# EAGLE design Bases_Aire_Sensors_v4 (EAGLE 9.6.2)
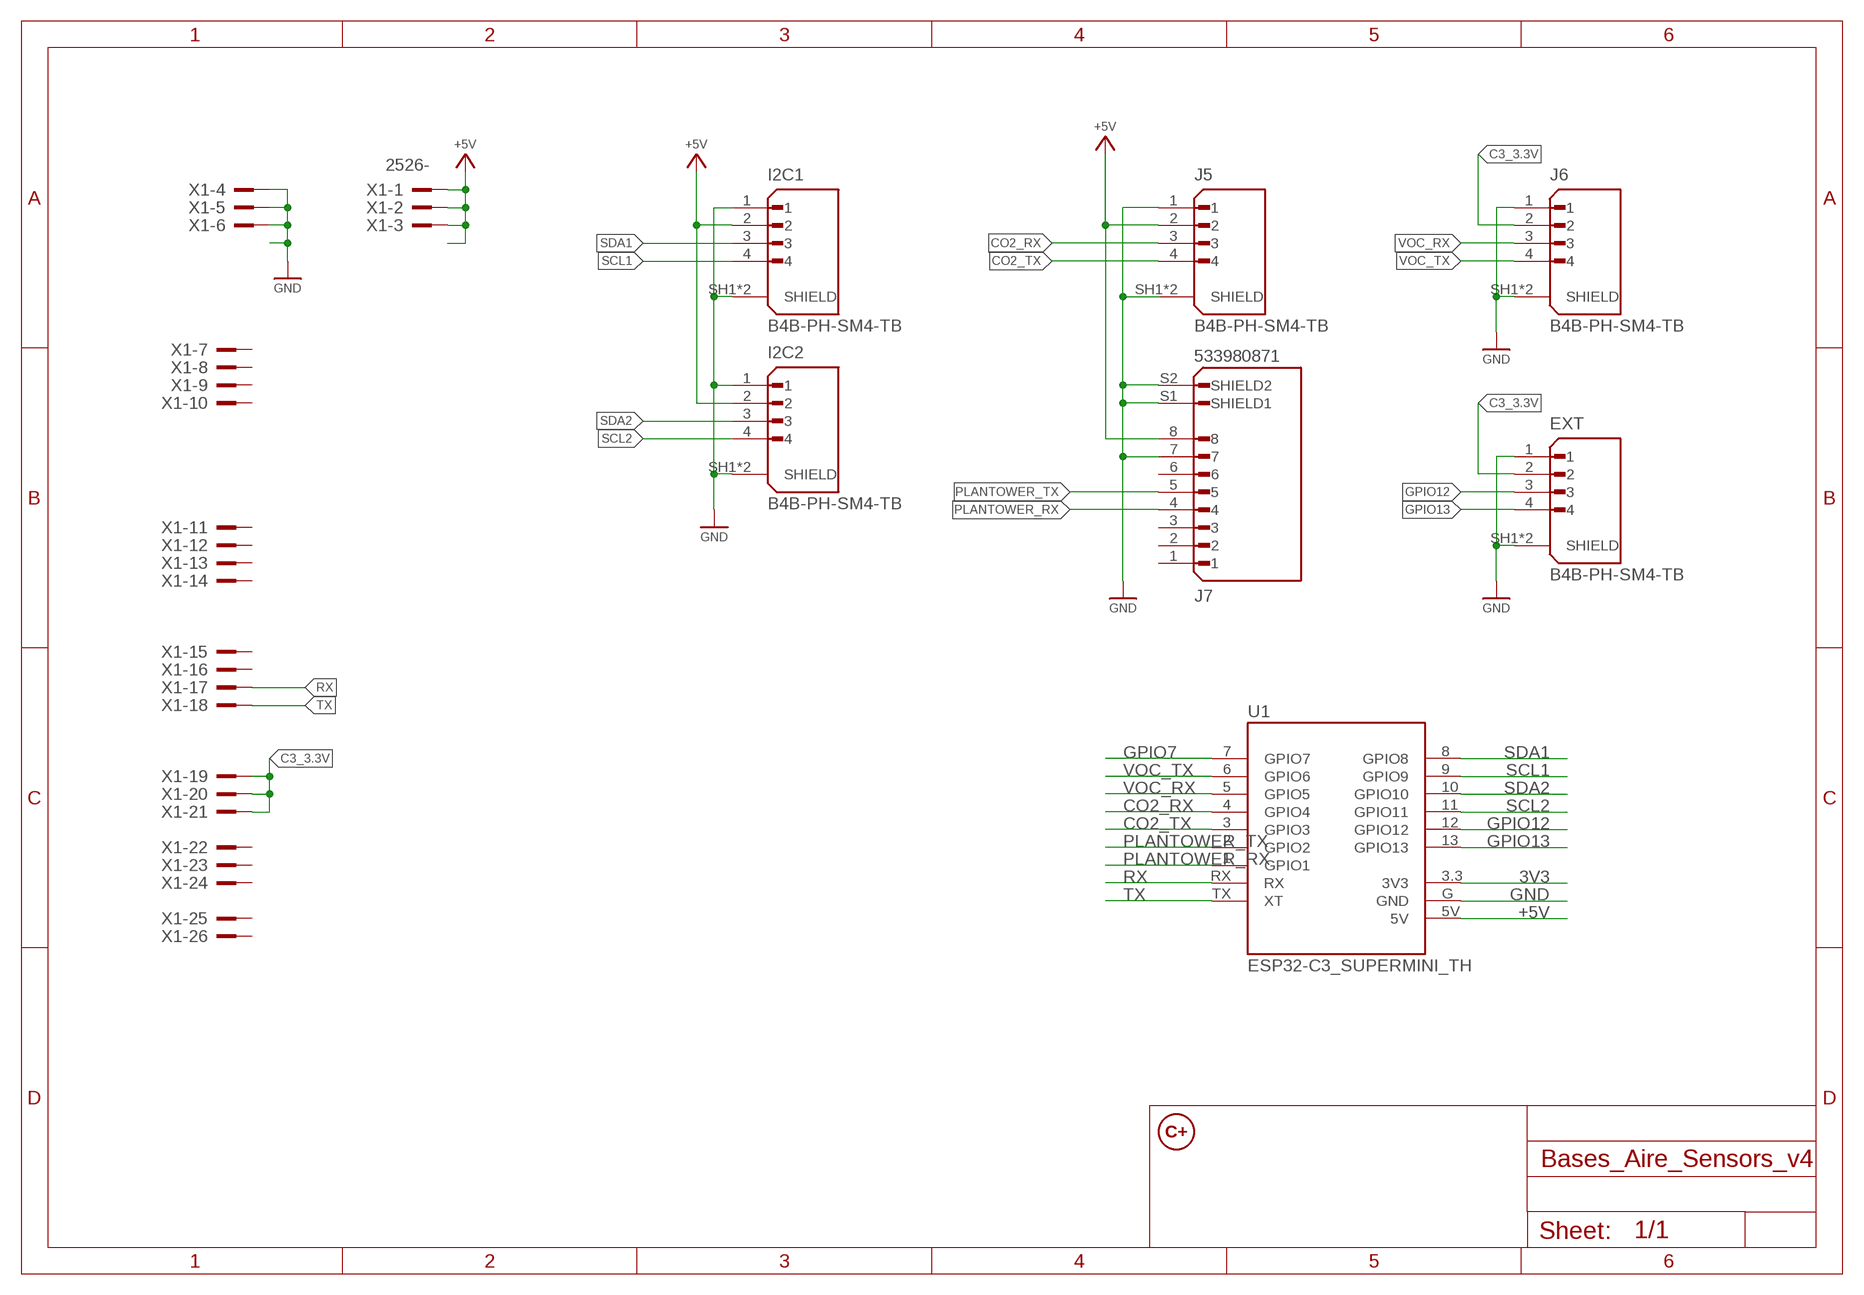
[diagram p0: schematic, sheet 1]

## Parts
EXT  B4B-PH-SM4-TB  [JST_B4B-PH-SM4-TB]
I2C1  B4B-PH-SM4-TB  [JST_B4B-PH-SM4-TB]
I2C2  B4B-PH-SM4-TB  [JST_B4B-PH-SM4-TB]
J5  B4B-PH-SM4-TB  [JST_B4B-PH-SM4-TB]
J6  B4B-PH-SM4-TB  [JST_B4B-PH-SM4-TB]
J7  533980871  [MOLEX_533980871]
U1  ESP32-C3_SUPERMINI_TH  [MODULE_ESP32-C3_SUPERMINI_TH]
U$1  LOGO_CMAS10MM  [LOGO_10MM]
X1  2526-  [PAK100/2500-26]

## Nets
3V3: U1.3.3(3V3)
+5V: I2C1.2 I2C2.2 J5.2 J7.8 U1.5V X1.1 X1.2 X1.3
C3_3.3V: EXT.2 J6.2 X1.19 X1.20 X1.21
CO2_RX: J5.3 U1.4(GPIO4)
CO2_TX: J5.4 U1.3(GPIO3)
GND: EXT.1 EXT.SH1(SHIELD) EXT.SH2(SHIELD) I2C1.1 I2C1.SH1(SHIELD) I2C1.SH2(SHIELD) I2C2.1 I2C2.SH1(SHIELD) I2C2.SH2(SHIELD) J5.1 J5.SH1(SHIELD) J5.SH2(SHIELD) J6.1 J6.SH1(SHIELD) J6.SH2(SHIELD) J7.7 J7.S1(SHIELD1) J7.S2(SHIELD2) U1.G(GND) X1.4 X1.5 X1.6
GPIO7: U1.7(GPIO7)
GPIO12: EXT.3 U1.12(GPIO12)
GPIO13: EXT.4 U1.13(GPIO13)
PLANTOWER_RX: J7.4 U1.1(GPIO1)
PLANTOWER_TX: J7.5 U1.2(GPIO2)
RX: U1.RX X1.17
SCL1: I2C1.4 U1.9(GPIO9)
SCL2: I2C2.4 U1.11(GPIO11)
SDA1: I2C1.3 U1.8(GPIO8)
SDA2: I2C2.3 U1.10(GPIO10)
TX: U1.TX(XT) X1.18
VOC_RX: J6.3 U1.5(GPIO5)
VOC_TX: J6.4 U1.6(GPIO6)
Unconnected: J7.1 J7.2 J7.3 J7.6 X1.7 X1.8 X1.9 X1.10 X1.11 X1.12 X1.13 X1.14 X1.15 X1.16 X1.22 X1.23 X1.24 X1.25 X1.26

## Library data of the parts
EXT I2C1 I2C2 J5 J6 = con-jst_ph:B4B-PH-SM4-TB: Check availability <https://pricing.snapeda.com/parts/B4B-PH-SM4-TB/JST%20Sales/view-part?ref=eda>; AVAILABILITY: In Stock; CHECK_PRICES: https://www.snapeda.com/parts/B4B-PH-SM4-TB/JST+Sales+America+Inc./view-part/?ref=eda; DESCRIPTION: Connector Header Surface Mount 4 position 0.079 (2.00mm); MF: JST Sales; MP: B4B-PH-SM4-TB; PACKAGE: NON STANDARD-4 JST; PRICE: None; SNAPEDA_LINK: https://www.snapeda.com/parts/B4B-PH-SM4-TB/JST+Sales+America+Inc./view-part/?ref=snap
J7 = 533980871:533980871: Check availability <https://pricing.snapeda.com/parts/53398-0871/Molex/view-part?ref=eda>; AVAILABILITY: In Stock; CHECK_PRICES: https://www.snapeda.com/parts/53398-0871/Molex/view-part/?ref=eda; DESCRIPTION: Conn; Rect; Header; 1.25 mm Pitch; PCB; 8 Cir; Ver; SMT; PicoBlade; LF | Molex Incorporated 53398-0871; MF: Molex; MP: 53398-0871; PACKAGE: None; PRICE: None; SNAPEDA_LINK: https://www.snapeda.com/parts/53398-0871/Molex/view-part/?ref=snap
U1 = ESP32-S3_SUPERMINI_TH:ESP32-C3_SUPERMINI_TH: Biblioteca modificada para esp32 s3 super mini; AVAILABILITY: Not in stock; DESCRIPTION: Super tiny ESP32-S3; MARCA: model S3 esp32; MF: Espressif Systems; MODEL: esp32 S3; MP: ESP32-S3 SuperMini_TH; PACKAGE: Package
U$1 = logoCmas:LOGO_CMAS
X1 = con-3m:2526-: 3M (TM) Pak 100 4-Wall Header Source: 3M; OC_FARNELL: unknown; OC_NEWARK: unknown

## Board
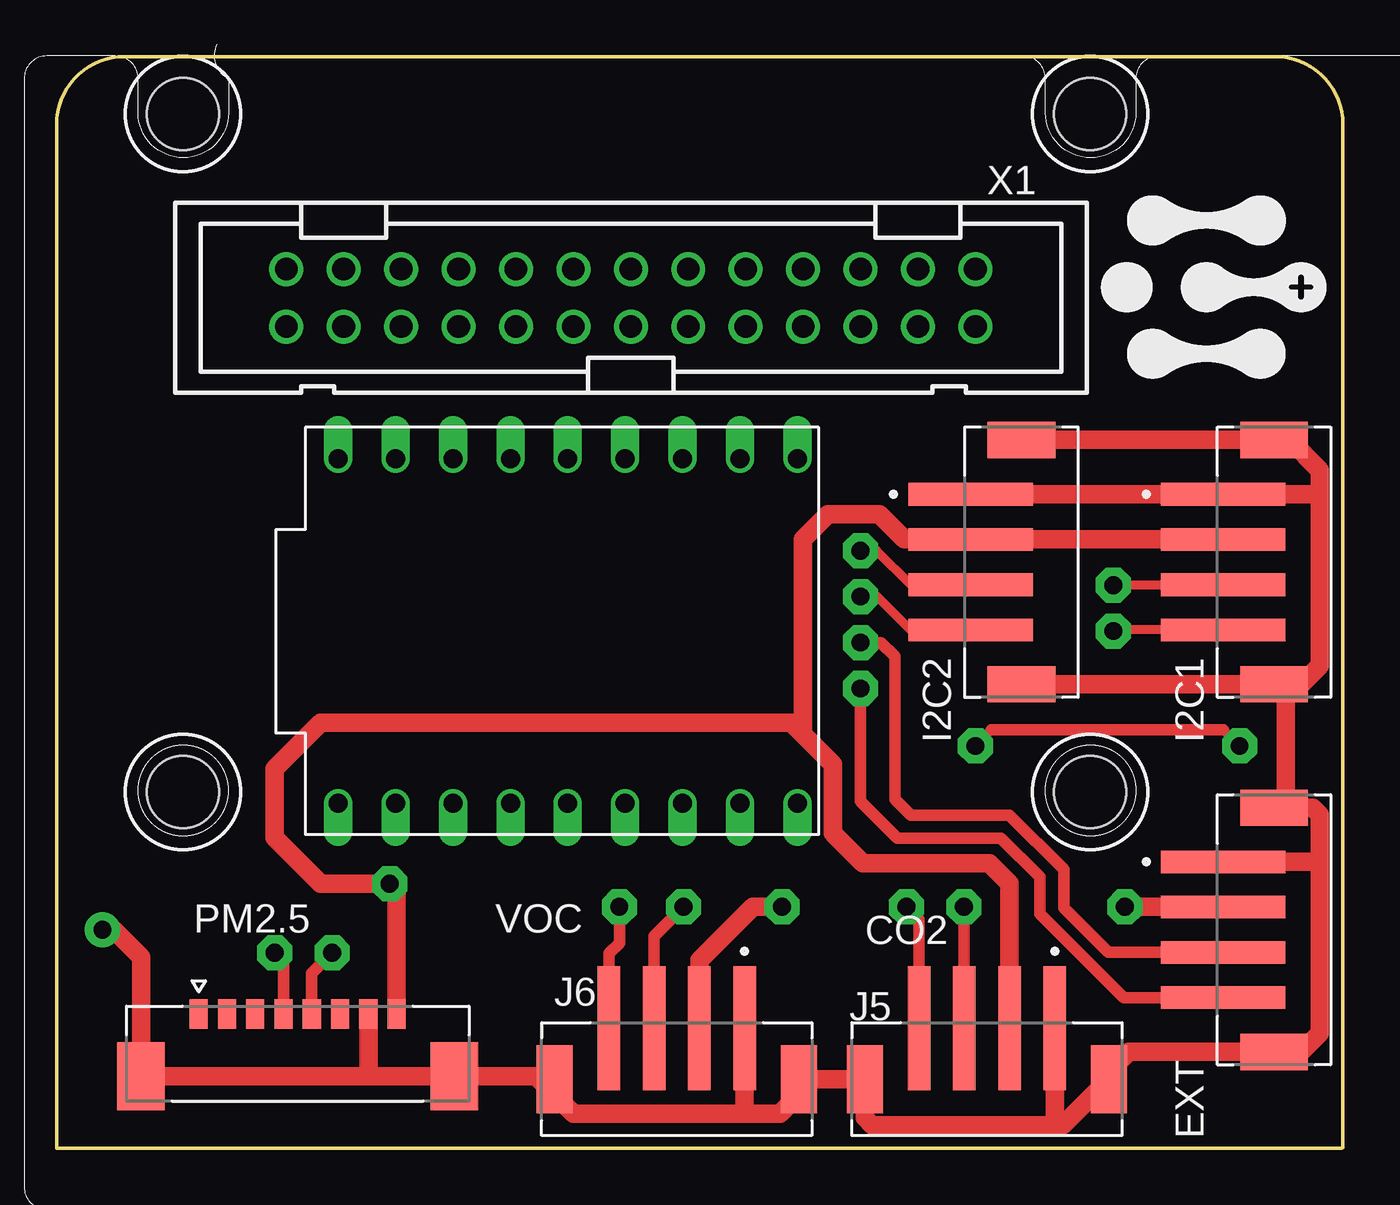
[diagram p1: board, top side]
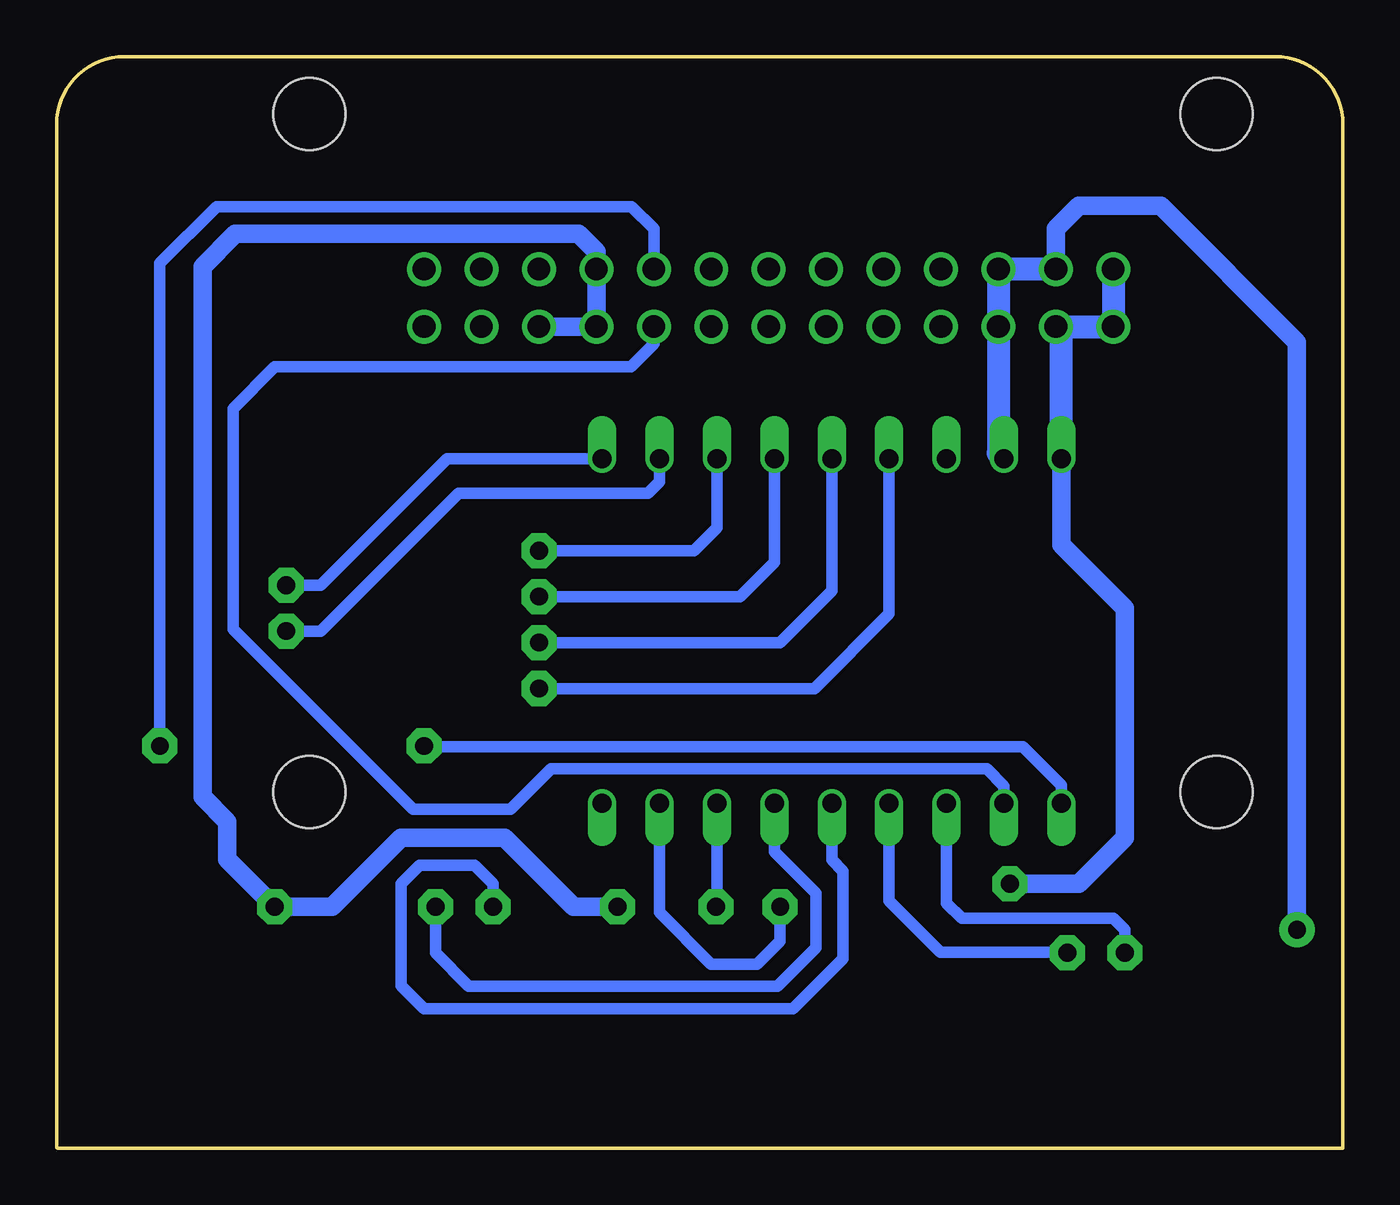
[diagram p2: board, bottom side, seen from below]

Size 56.9 x 48.26 mm. Coordinates in mm from the lower left corner, seen from the top.
Outline: 0,0 56.82,0 arc90 56.9,0.08 56.9,45.26 arc90 53.9,48.26 3,48.26 arc90 0,45.26 0,0
Copper layers (1*16): Top 0.035mm / dielectric 1.5mm / Bottom 0.035mm
Design rules "OthermillDRC_1_64_v2": minimum track width 16mil, minimum drill 31mil, track to track 0.39878125mm, track to pad 0.39878125mm, pad to pad 0.39878125mm, via to via 0.39878125mm, smd to smd 0mil, copper to edge 0mil, drill to drill 1mil, minimum pad ring 0mil, minimum via ring 15mil, stop-mask expansion 1mil, vias tented up to drill 30mil, thermal gap 10mil
Holes 3.2 mm at 5.59,15.75 5.59,45.72 45.72,45.72 45.72,15.75

### Footprints (pad centres in the part's own frame; a part is rotated, then mirrored left to right if it is on the bottom)
JST_B4B-PH-SM4-TB = smd 1 x 5.5: 1 -3,-2.25; 2 -1,-2.25; 3 1,-2.25; 4 3,-2.25 | smd 1.6 x 3: SH1 -5.4,0; SH2 5.4,0
MOLEX_533980871 = smd 0.8 x 1.3: 1 4.375,-1.75; 2 3.125,-1.75; 3 1.875,-1.75; 4 0.625,-1.75; 5 -0.625,-1.75; 6 -1.875,-1.75; 7 -3.125,-1.75; 8 -4.375,-1.75 | smd 2.1 x 3: S1 -6.925,1; S2 6.925,1
MODULE_ESP32-C3_SUPERMINI_TH = drill 0.84 offset: 1 -7.62,4.82; 2 -7.62,2.28; 3 -7.62,-0.26; 3.3 7.62,4.82; 4 -7.62,-2.8; 5 -7.62,-5.34; 5V 7.62,9.9; 6 -7.62,-7.88; 7 -7.62,-10.42; 8 7.62,-10.42; 9 7.62,-7.88; 10 7.62,-5.34; 11 7.62,-2.8; 12 7.62,-0.26; 13 7.62,2.28; G 7.62,7.36; RX -7.62,7.36; TX -7.62,9.9
PAK100/2500-26 = drill 1 pad 1.422: 1 -15.24,-1.27; 2 -15.24,1.27; 3 -12.7,-1.27; 4 -12.7,1.27; 5 -10.16,-1.27; 6 -10.16,1.27; 7 -7.62,-1.27; 8 -7.62,1.27; 9 -5.08,-1.27; 10 -5.08,1.27; 11 -2.54,-1.27; 12 -2.54,1.27; 13 0,-1.27; 14 0,1.27; 15 2.54,-1.27; 16 2.54,1.27; 17 5.08,-1.27; 18 5.08,1.27; 19 7.62,-1.27; 20 7.62,1.27; 21 10.16,-1.27; 22 10.16,1.27; 23 12.7,-1.27; 24 12.7,1.27; 25 15.24,-1.27; 26 15.24,1.27

### Placement (x,y rotation side)
EXT  53.85,9.65 270 top
I2C1  53.85,25.91 270 top
I2C2  42.67,25.91 270 top
J5  41.15,3.05 180 top
J6  27.43,3.05 180 top
J7  10.67,4.18 180 top
U1  22.35,22.86 90 top
U$1  50.8,38.1 0 top
X1  25.4,37.59 0 top

### Tracks (layer width: path | path; a pad name or v marks a point on that pad's centre or on a via)
+5V  (via drill 0.79)
  Top 0.813: I2C1.2 I2C2.2 37.51,26.91 36.4,28.02 34.11,28.02 33.02,26.92 33.02,18.29 | J7.8 15.04,11.37 v14.73,11.68 11.68,11.68 9.65,13.72 9.65,16.76 11.68,18.8 32.51,18.8 33.02,18.29 | J5.2 42.15,11.7 41.25,12.6 35.66,12.6 34.34,13.92 34.34,16.96 33.02,18.29
  Bottom 0.813: v14.73,11.68 11.68,11.68 9.65,13.72 9.65,23.88 12.45,26.68 12.45,30.99
  Bottom 1.016: X1.2 X1.1 X1.3 12.45,36.07 12.45,30.99 U1.5V
C3_3.3V  (via drill 0.79)
  Top 0.813: v47.24,10.67 51.58,10.67 EXT.2 | J6.2 28.43,8.3 30.8,10.67 v32.09,10.67
  Bottom 0.813: X1.21 X1.19 X1.20 33.02,39.62 33.82,40.42 48.99,40.42 50.43,38.97 50.43,15.53 49.34,14.44 49.34,12.77 v47.24,10.67 44.7,10.67 41.66,13.72 37.08,13.72 34.04,10.67 v32.09,10.67
CO2_RX  (via drill 0.79)
  Top 0.406: 40.13,5.31 J5.3
  Top 0.508: v40.13,10.67 40.13,5.31
  Bottom 0.508: U1.4 25.15,13.1 23.31,11.27 23.31,8.86 25.01,7.17 38.66,7.17 40.13,8.64 v40.13,10.67
CO2_TX  (via drill 0.79)
  Top 0.508: J5.4 38.15,10.11 v37.59,10.67
  Bottom 0.508: U1.3 22.61,12.74 22.11,12.24 22.11,8.37 24.32,6.16 40.64,6.16 41.66,7.17 41.66,11.68 40.84,12.5 38.41,12.5 37.59,11.68 v37.59,10.67
GND  (via drill 0.79)
  Top 0.813: I2C2.1 I2C1.1 55.83,28.91 55.88,28.96 | I2C2.SH1 I2C1.SH1 54.54,31.31 55.88,29.97 55.88,28.96 | I2C2.SH2 I2C1.SH2 | 13.72,3.18 J7.S2 3.74,8.45 2.54,9.65 v2.03,9.65 | 13.72,3.18 J7.S1 21.34,3.18 | J7.7 13.79,3.25 13.72,3.18 | 21.34,3.18 21.9,3.18 J6.SH2 | 21.34,3.18 21.34,3.05 22.86,1.52 30.48,1.52 | 30.48,1.52 32,1.52 32.83,2.35 J6.SH1 J5.SH2 35.75,1.34 36.07,1.02 44.2,1.02 | J6.1 30.43,1.57 30.48,1.52 | 44.2,1.02 44.52,1.02 J5.SH1 46.55,3.37 47.43,4.25 EXT.SH2 55.05,4.25 55.88,5.08 55.88,12.7 | J5.1 44.15,1.06 44.2,1.02 | 55.88,12.7 55.88,14.73 55.56,15.05 EXT.SH1 54.36,15.56 54.36,20 I2C1.SH2 | EXT.1 55.83,12.65 55.88,12.7 | 55.88,28.96 55.88,21.34 55.05,20.51 I2C1.SH2
  Bottom 0.813: X1.4 12.7,40.64 11.68,41.66 8.06,41.66 2.03,35.62 v2.03,9.65
  Bottom 1.016: X1.4 X1.6 X1.5 15.24,30.73 U1.G
GPIO12  (via drill 0.79)
  Top 0.508: v35.56,22.35 36.47,22.35 37.08,21.74 37.08,15.43 37.8,14.72 42.15,14.72 44.54,12.33 44.54,10.62 46.52,8.65 EXT.3
  Bottom 0.508: v35.56,22.35 24.89,22.35 22.61,24.63 U1.12
GPIO13  (via drill 0.79)
  Top 0.508: EXT.4 47.2,6.65 43.48,10.37 43.48,11.99 41.77,13.71 37.19,13.71 35.56,15.33 v35.56,20.32
  Bottom 0.508: U1.13 20.07,23.62 23.37,20.32 v35.56,20.32
PLANTOWER_RX  (via drill 0.79)
  Top 0.508: J7.4 10.04,8.25 v9.65,8.64
  Bottom 0.508: U1.1 17.53,10.83 16.86,10.16 10.16,10.16 9.65,9.65 v9.65,8.64
PLANTOWER_TX  (via drill 0.79)
  Top 0.508: J7.5 11.29,7.74 v12.19,8.64
  Bottom 0.508: v12.19,8.64 12.21,8.66 17.8,8.66 20.07,10.93 U1.2
RX
  Bottom 0.508: U1.RX 14.99,16.01 15.75,16.76 35.03,16.76 36.8,14.99 41.13,14.99 49.09,22.94 49.09,32.7 47.24,34.54 31.5,34.54 30.48,35.56 X1.17
SCL1  (via drill 0.79)
  Top 0.406: I2C1.4 46.78,22.91 v46.74,22.86
  Bottom 0.508: U1.9 30.23,29.46 30.74,28.96 39.12,28.96 45.21,22.86 v46.74,22.86
SCL2  (via drill 0.79)
  Top 0.406: I2C2.4 37.77,22.91 36.3,24.38 v35.56,24.38
  Bottom 0.508: U1.11 25.15,25.91 26.68,24.38 v35.56,24.38
SDA1  (via drill 0.79)
  Top 0.406: I2C1.3 51.58,24.89 v46.74,24.89
  Bottom 0.508: v46.74,24.89 45.21,24.89 39.62,30.48 U1.8
SDA2  (via drill 0.79)
  Top 0.406: I2C2.3 37.78,24.91 36.27,26.42 v35.56,26.42
  Bottom 0.508: U1.10 27.69,27.43 28.71,26.42 v35.56,26.42
TX  (via drill 0.79)
  Top 0.406: v52.32,17.78 51.61,18.5 | 41.36,18.5 v40.64,17.78
  Top 0.508: 51.61,18.5 41.36,18.5
  Bottom 0.508: v52.32,17.78 52.32,39.12 49.81,41.63 31.47,41.63 30.48,40.64 X1.18 | U1.TX 12.45,16.04 14.15,17.74 40.48,17.74 40.51,17.78 v40.64,17.78
VOC_RX  (via drill 0.79)
  Top 0.508: J6.3 26.43,9.37 v27.73,10.67
  Bottom 0.508: v27.73,10.67 27.69,10.71 U1.5
VOC_TX  (via drill 0.79)
  Top 0.508: J6.4 24.43,8.61 24.89,9.07 v24.89,10.67
  Bottom 0.508: v24.89,10.67 24.89,9.14 25.91,8.13 27.94,8.13 30.23,10.42 U1.6

### Text on the board
tPlace: PM2.5 | VOC | CO2